# Altium schematic sheet C210_0000_Topsheet_220601.SchDoc: C210_0000_Topsheet
size B; Date: 2/26/2021; CompanyName: U-blox; DrawnBy: EMOO; Engineer: EMOO; Organization: U-blox; Address1: 2601 25th St. SE; Address2: Salem, OR 97302; SheetNumber: 0; SheetTotal: 7; Website: www.u-blox.com; SheetSize: B; SheetTitle: C-210 Topsheet
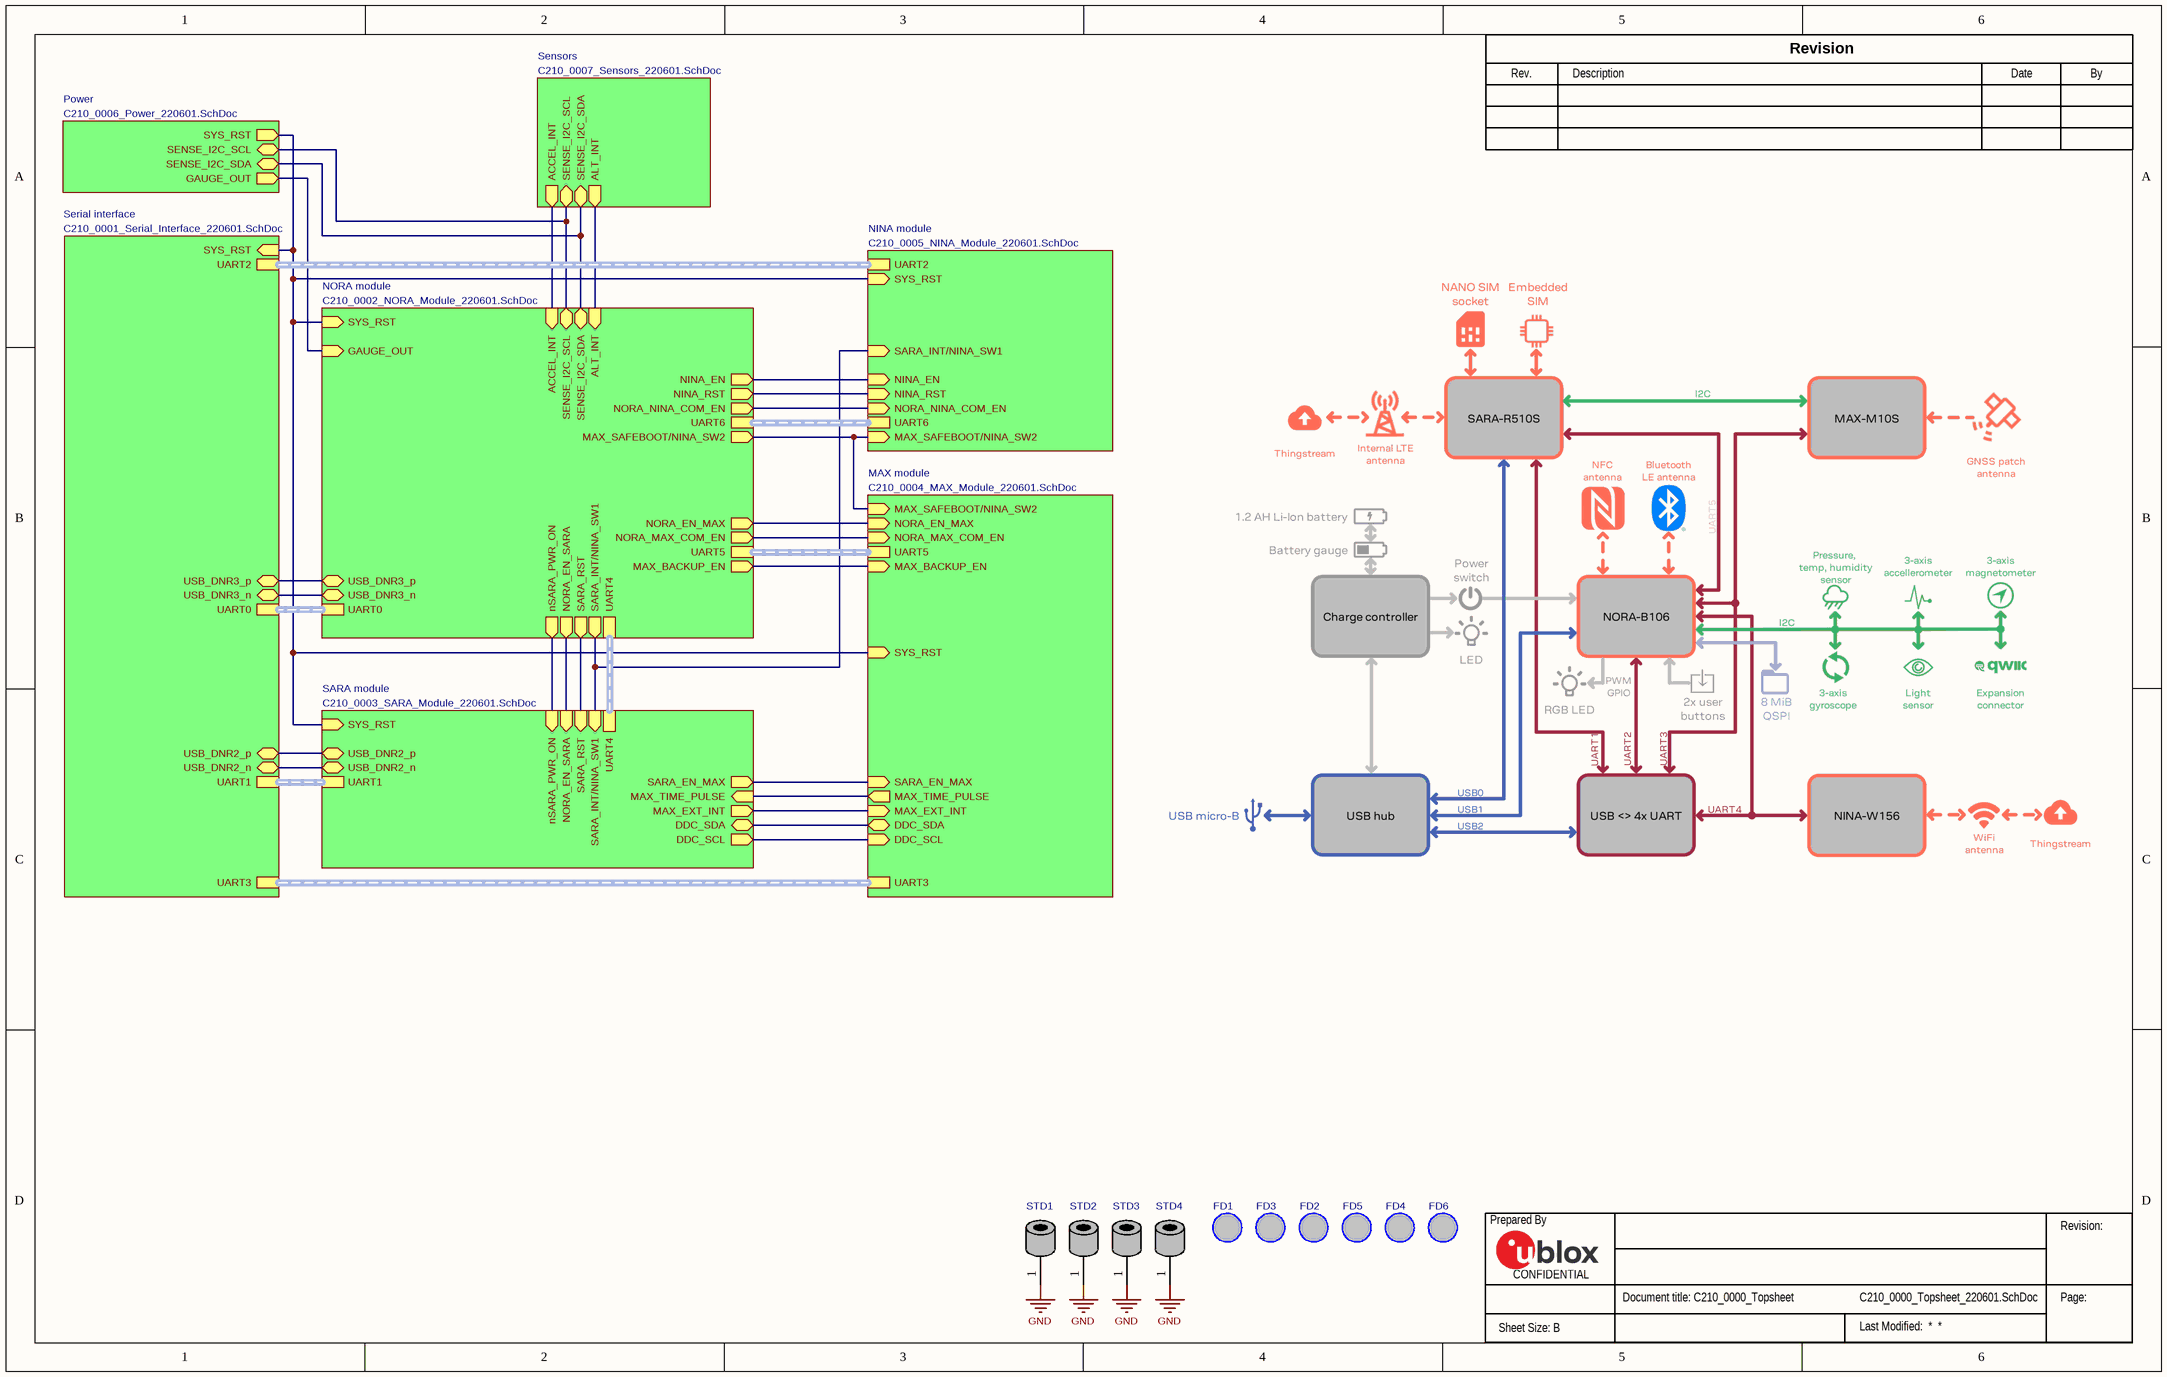
[diagram p0: C210_0000_Topsheet_220601.SchDoc]

## Parts
(Parts that share a designator on the sheet are numbered #1, #2 ... from top to bottom, then left to right.)
?#1  (no value)  (graphical)
?#2  (no value)  (graphical)
FD1  Fiducial_1mmDNP  [Fiducial 1mm - Circle]  (value not drawn)  (no BOM)
FD2  Fiducial_1mmDNP  [Fiducial 1mm - Circle]  (value not drawn)  (no BOM)
FD3  Fiducial_1mmDNP  [Fiducial 1mm - Circle]  (value not drawn)  (no BOM)
FD4  Fiducial_1mmDNP  [Fiducial 1mm - Circle]  (value not drawn)  (no BOM)
FD5  Fiducial_1mmDNP  [Fiducial 1mm - Circle]  (value not drawn)  (no BOM)
FD6  Fiducial_1mmDNP  [Fiducial 1mm - Circle]  (value not drawn)  (no BOM)
STD1  (no value)  [9774020951R]
STD2  (no value)  [9774020951R]
STD3  (no value)  [9774020951R]
STD4  (no value)  [9774020951R]

## Sub-sheets
MAX module = C210_0004_MAX_Module_220601.SchDoc: DDC_SCL (in), DDC_SDA (bidir), UART3 (harness UART3), UART5 (harness UART5), MAX_BACKUP_EN (in), MAX_TIME_PULSE (out), NORA_EN_MAX (in), SARA_EN_MAX (in), NORA_MAX_COM_EN (in), MAX_EXT_INT (in), SYS_RST (in), MAX_SAFEBOOT/NINA_SW2 (in)
NINA module = C210_0005_NINA_Module_220601.SchDoc: UART6 (harness UART6), NORA_NINA_COM_EN (in), NINA_RST (in), UART2 (harness UART2), SYS_RST (in), NINA_EN (in), SARA_INT/NINA_SW1 (in), MAX_SAFEBOOT/NINA_SW2 (in)
NORA module = C210_0002_NORA_Module_220601.SchDoc: UART0 (harness UART0), UART4 (harness UART4), SARA_RST (out), UART5 (harness UART5), ACCEL_INT (in), SENSE_I2C_SDA (bidir), SENSE_I2C_SCL (bidir), NORA_MAX_COM_EN (out), NORA_EN_MAX (out), UART6 (harness UART6), NINA_EN (out), NORA_NINA_COM_EN (out), nSARA_PWR_ON (out), MAX_BACKUP_EN (out), NINA_RST (out), USB_DNR3_p (bidir), USB_DNR3_n (bidir), SYS_RST (in), NORA_EN_SARA (out), GAUGE_OUT (in), ALT_INT (in), SARA_INT/NINA_SW1 (out), MAX_SAFEBOOT/NINA_SW2 (out)
Power = C210_0006_Power_220601.SchDoc: SYS_RST (out), GAUGE_OUT (out), SENSE_I2C_SCL (bidir), SENSE_I2C_SDA (bidir)
SARA module = C210_0003_SARA_Module_220601.SchDoc: UART4 (harness UART4), DDC_SDA (bidir), DDC_SCL (out), SARA_RST (in), MAX_TIME_PULSE (in), MAX_EXT_INT (out), SARA_EN_MAX (out), nSARA_PWR_ON (in), USB_DNR2_n (bidir), USB_DNR2_p (bidir), UART1 (harness UART1), SYS_RST (in), NORA_EN_SARA (in), SARA_INT/NINA_SW1 (in)
Sensors = C210_0007_Sensors_220601.SchDoc: SENSE_I2C_SCL (bidir), ACCEL_INT (out), SENSE_I2C_SDA (bidir), ALT_INT (out)
Serial interface = C210_0001_Serial_Interface_220601.SchDoc: UART1 (harness UART1), UART3 (harness UART3), UART2 (harness UART2), UART0 (harness UART0), USB_DNR2_p (bidir), USB_DNR2_n (bidir), USB_DNR3_p (bidir), USB_DNR3_n (bidir), SYS_RST (in)

## Nets
GND: STD1.1 STD2.1 STD3.1 STD4.1
(unnamed): sheet NORA module/SARA_RST, sheet SARA module/SARA_RST
(unnamed): sheet NORA module/ACCEL_INT, sheet Sensors/ACCEL_INT
(unnamed): sheet NORA module/SENSE_I2C_SDA, sheet Power/SENSE_I2C_SDA, sheet Sensors/SENSE_I2C_SDA
(unnamed): sheet NORA module/SENSE_I2C_SCL, sheet Power/SENSE_I2C_SCL, sheet Sensors/SENSE_I2C_SCL
(unnamed): sheet NORA module/NORA_MAX_COM_EN, sheet MAX module/NORA_MAX_COM_EN
(unnamed): sheet NORA module/NORA_EN_MAX, sheet MAX module/NORA_EN_MAX
(unnamed): sheet NORA module/NINA_EN, sheet NINA module/NINA_EN
(unnamed): sheet NORA module/NORA_NINA_COM_EN, sheet NINA module/NORA_NINA_COM_EN
(unnamed): sheet NORA module/nSARA_PWR_ON, sheet SARA module/nSARA_PWR_ON
(unnamed): sheet NORA module/MAX_BACKUP_EN, sheet MAX module/MAX_BACKUP_EN
(unnamed): sheet NORA module/NINA_RST, sheet NINA module/NINA_RST
(unnamed): sheet NORA module/USB_DNR3_p, sheet Serial interface/USB_DNR3_p
(unnamed): sheet NORA module/USB_DNR3_n, sheet Serial interface/USB_DNR3_n
(unnamed): sheet NORA module/SYS_RST, sheet SARA module/SYS_RST, sheet Power/SYS_RST, sheet Serial interface/SYS_RST, sheet MAX module/SYS_RST, sheet NINA module/SYS_RST
(unnamed): sheet NORA module/NORA_EN_SARA, sheet SARA module/NORA_EN_SARA
(unnamed): sheet NORA module/GAUGE_OUT, sheet Power/GAUGE_OUT
(unnamed): sheet NORA module/ALT_INT, sheet Sensors/ALT_INT
(unnamed): sheet NORA module/SARA_INT/NINA_SW1, sheet SARA module/SARA_INT/NINA_SW1, sheet NINA module/SARA_INT/NINA_SW1
(unnamed): sheet NORA module/MAX_SAFEBOOT/NINA_SW2, sheet MAX module/MAX_SAFEBOOT/NINA_SW2, sheet NINA module/MAX_SAFEBOOT/NINA_SW2
(unnamed): sheet SARA module/DDC_SDA, sheet MAX module/DDC_SDA
(unnamed): sheet SARA module/DDC_SCL, sheet MAX module/DDC_SCL
(unnamed): sheet SARA module/MAX_TIME_PULSE, sheet MAX module/MAX_TIME_PULSE
(unnamed): sheet SARA module/MAX_EXT_INT, sheet MAX module/MAX_EXT_INT
(unnamed): sheet SARA module/SARA_EN_MAX, sheet MAX module/SARA_EN_MAX
(unnamed): sheet SARA module/USB_DNR2_n, sheet Serial interface/USB_DNR2_n
(unnamed): sheet SARA module/USB_DNR2_p, sheet Serial interface/USB_DNR2_p

## Buses and harness runs
harness sheet MAX module/UART3 = sheet Serial interface/UART3
harness sheet MAX module/UART5 = sheet NORA module/UART5
harness sheet NINA module/UART2 = sheet Serial interface/UART2
harness sheet NINA module/UART6 = sheet NORA module/UART6
harness sheet NORA module/UART0 = sheet Serial interface/UART0
harness sheet NORA module/UART4 = sheet SARA module/UART4
harness sheet SARA module/UART1 = sheet Serial interface/UART1

## Notes on the sheet
- Rev.
- Description
- Revision
- Date
- By
- Prepared By
- Revision:
- CONFIDENTIAL
- Page:

## Library data of the parts
?#1 = Top_Revision_Block: Release Revision History Block
?#2 = Top_Title_Block: Top level schematic title block for top level sheet
FD1-FD6 = Fiducial_1mm_Circle: 1mm Fiducial Target; Added By: EMOO; Part Number: Fiducial_1mm; Height: 0; DNP: DNP; Added Date: 12/12/2020
STD1-STD4 = 9774020951R: Standoff, SMT, 2mm, Unthreaded, 2.7mm ID, 5.1mm OD, Steel, Plated; Manufacturer 1: Würth Elektronik; Part Name: SMT STD 2mm; Item Phase: In Production; Use in new designs: Yes; Voltage: None; Part Number: 9774020951R; Manufacturer Part Number 1: 9774020951R; Supplier 1: None; Supplier Part Number 1: None; Diameter: None; Height: 2mm; Max Operating Temp: None; Min Operating Temp: None; Pins: 1; Revision: 0A; UBX Code: None; Manufacturer 2: None; Manufacturer Part Number 2: None; Supplier 2: None; Supplier Part Number 2: None